# Altium project INS_Housing.PrjPcb
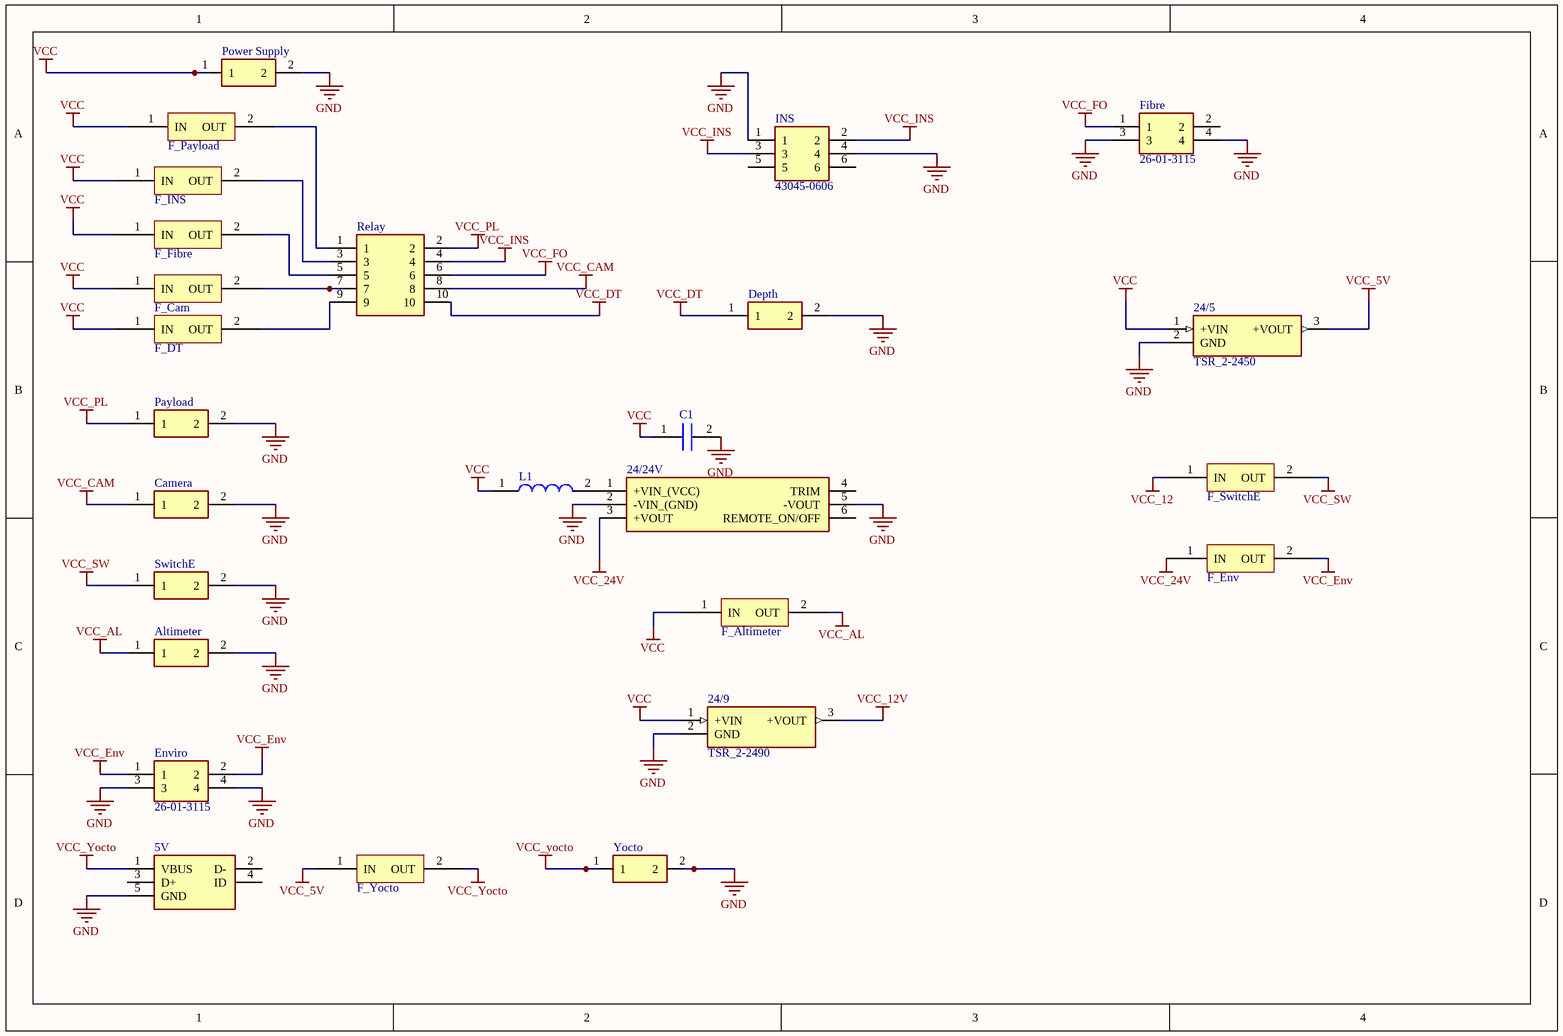
[diagram p0: Main.SchDoc]
1 sheet, 26 parts. Net scope: global (net labels, ports and power ports of the same name join across sheets).
Board file: Main.PcbDoc

## Sheet Main.SchDoc: Squidbot INS Powerboard
size A4; Author: Renan Freitas; DocumentNumber: SQBT-S-0002; Revision: 0; SheetSize: A4; DocumentName: SQBT-S-0002

### Parts
5V  47346-0001  [47346-0001]  (value not drawn)
24/5  TSR_2-2450  [TSR-2]
24/9  TSR_2-2490  [TSR-2]
24/24V  THN_30-2415WI  [THN_30]  (value not drawn)
Altimeter  43650-0212  [43650-0214]  (value not drawn)
C1  C0805S472K5RACAUTO  [CAPC2012X88N]  (value not drawn)
Camera  43650-0212  [43650-0214]  (value not drawn)
Depth  43650-0212  [43650-0214]  (value not drawn)
Enviro  26-01-3115  [39-30-1040]
F_Altimeter  FUSEHOLDERS PC Mount 5x20mm Fuses  [FUSEHOLDER 5x20]  (value not drawn)
F_Cam  FUSEHOLDERS PC Mount 5x20mm Fuses  [FUSEHOLDER 5x20]  (value not drawn)
F_DT  FUSEHOLDERS PC Mount 5x20mm Fuses  [FUSEHOLDER 5x20]  (value not drawn)
F_Env  FUSEHOLDERS PC Mount 5x20mm Fuses  [FUSEHOLDER 5x20]  (value not drawn)
F_Fibre  FUSEHOLDERS PC Mount 5x20mm Fuses  [FUSEHOLDER 5x20]  (value not drawn)
F_INS  FUSEHOLDERS PC Mount 5x20mm Fuses  [FUSEHOLDER 5x20]  (value not drawn)
F_Payload  FUSEHOLDERS PC Mount 5x20mm Fuses  [FUSEHOLDER 5x20]  (value not drawn)
F_SwitchE  FUSEHOLDERS PC Mount 5x20mm Fuses  [FUSEHOLDER 5x20]  (value not drawn)
F_Yocto  FUSEHOLDERS PC Mount 5x20mm Fuses  [FUSEHOLDER 5x20]  (value not drawn)
Fibre  26-01-3115  [39-30-1040]
INS  43045-0606  [43045-0606]
L1  XEL6060-222MEB  [XAL6060153MEC]  (value not drawn)
Payload  43650-0212  [43650-0214]  (value not drawn)
Power_Supply  76825-0002  [768250002]  (value not drawn)
Relay  105405-1110  [105405-1110]  (value not drawn)
SwitchE  43650-0212  [43650-0214]  (value not drawn)
Yocto  43650-0212  [43650-0214]  (value not drawn)

### Nets
GND: 5V.5(GND) 24/5.2(GND) 24/9.2(GND) 24/24V.2(-VIN_(GND)) 24/24V.5(-VOUT) Altimeter.2 C1.2 Camera.2 Depth.2 Enviro.3 Enviro.4 Fibre.3 Fibre.4 INS.1 INS.4 Payload.2 Power_Supply.2 SwitchE.2 Yocto.2
VCC: 24/5.1(+VIN) 24/9.1(+VIN) C1.1 F_Altimeter.1(IN) F_Cam.1(IN) F_DT.1(IN) F_Fibre.1(IN) F_INS.1(IN) F_Payload.1(IN) L1.1 Power_Supply.1
VCC_5V: 24/5.3(+VOUT) F_Yocto.1(IN)
VCC_12: F_SwitchE.1(IN)
VCC_12V: 24/9.3(+VOUT)
VCC_24V: 24/24V.3(+VOUT) F_Env.1(IN)
VCC_AL: Altimeter.1 F_Altimeter.2(OUT)
VCC_CAM: Camera.1 Relay.8
VCC_DT: Depth.1 Relay.10
VCC_Env: Enviro.1 Enviro.2 F_Env.2(OUT)
VCC_FO: Fibre.1 Relay.6
VCC_INS: INS.2 INS.3 Relay.4
VCC_PL: Payload.1 Relay.2
VCC_SW: F_SwitchE.2(OUT) SwitchE.1
VCC_Yocto: 5V.1(VBUS) F_Yocto.2(OUT) Yocto.1
Net24/24V_1: 24/24V.1(+VIN_(VCC)) L1.2
NetF_Cam_2: F_Cam.2(OUT) Relay.7
NetF_DT_2: F_DT.2(OUT) Relay.9
NetF_Fibre_2: F_Fibre.2(OUT) Relay.5
NetF_INS_2: F_INS.2(OUT) Relay.3
NetF_Payload_2: F_Payload.2(OUT) Relay.1

Not connected (* = marked no-connect by the designer): 5V 2(D-) 3(D+) 4(ID); 24/24V 4(TRIM) 6(REMOTE_ON/OFF); Fibre 2; INS 5 6

### Library data of the parts
5V = 47346-0001: Connector; Manufacturer_Name: Molex; Datasheet Link: https://componentsearchengine.com/Datasheets/1/47346-0001.pdf; Mouser Part Number: 538-47346-0001; Mouser Price/Stock: https://www.mouser.com/Search/Refine.aspx?Keyword=538-47346-0001; Manufacturer_Part_Number: 47346-0001
24/5 = TSR_2-2450: Power Supply; Manufacturer_Name: Traco Power; Manufacturer_Part_Number: TSR 2-2450; Datasheet Link: https://componentsearchengine.com/Datasheets/1/TSR 2-2450.pdf; Mouser Part Number: 495-TSR2-2450; Mouser Price/Stock: https://www.mouser.com/Search/Refine.aspx?Keyword=495-TSR2-2450
24/9 = TSR_2-2490: Power Supply; Manufacturer_Name: Traco Power; Manufacturer_Part_Number: TSR 2-2490; Datasheet Link: https://componentsearchengine.com/Datasheets/1/TSR 2-2490.pdf; Mouser Part Number: 495-TSR2-2490; Mouser Price/Stock: https://www.mouser.com/Search/Refine.aspx?Keyword=495-TSR2-2490
24/24V = THN_30-2415WI: Power Supply; Manufacturer_Name: Traco Power; Manufacturer_Part_Number: THN 30-2415WI; Datasheet Link: https://componentsearchengine.com/Datasheets/1/THN 30-2415WI.pdf; Mouser Part Number: 495-THN30-2415WI; Mouser Price/Stock: https://www.mouser.com/Search/Refine.aspx?Keyword=495-THN30-2415WI
Altimeter Camera Depth Payload SwitchE Yocto = 43650-0212: Connector; Manufacturer_Name: Molex; Datasheet Link: https://componentsearchengine.com/Datasheets/1/43650-0212.pdf; Mouser Part Number: 538-43650-0212; Mouser Price/Stock: https://www.mouser.com/Search/Refine.aspx?Keyword=538-43650-0212; Manufacturer_Part_Number: 43650-0212
C1 = C0805S472K5RACAUTO: Capacitor; Manufacturer_Name: Kemet; Datasheet Link: https://componentsearchengine.com/Datasheets/1/C0805S472K5RACAUTO.pdf; Height: 0.88mm; Mouser Part Number: 80-C0805S472K5RAUTO; Mouser Price/Stock: https://www.mouser.com/Search/Refine.aspx?Keyword=80-C0805S472K5RAUTO; Manufacturer_Part_Number: C0805S472K5RACAUTO
Enviro Fibre = 26-01-3115: Connector; Manufacturer_Name: Molex; Datasheet Link: https://componentsearchengine.com/Datasheets/1/26-01-3115.pdf; Mouser Part Number: 538-26-01-3115; Mouser Price/Stock: https://www.mouser.com/Search/Refine.aspx?Keyword=538-26-01-3115; Manufacturer_Part_Number: 26-01-3115
INS = 43045-0606: Connector; Manufacturer_Name: Molex; Datasheet Link: https://componentsearchengine.com/Datasheets/1/43045-0606.pdf; Mouser Part Number: 538-43045-0606; Mouser Price/Stock: https://www.mouser.com/Search/Refine.aspx?Keyword=538-43045-0606; Manufacturer_Part_Number: 43045-0606
L1 = XEL6060-222MEB: Inductor; Manufacturer_Name: COILCRAFT; Datasheet Link: https://componentsearchengine.com/Datasheets/1/XEL6060-222MEB.pdf; Mouser Part Number: 994-XEL6060-222MEB; Mouser Price/Stock: https://www.mouser.com/Search/Refine.aspx?Keyword=994-XEL6060-222MEB; Manufacturer_Part_Number: XEL6060-222MEB
Power_Supply = 76825-0002: Connector; Manufacturer_Name: Molex; Datasheet Link: https://componentsearchengine.com/Datasheets/1/76825-0002.pdf; Height: 14mm; Mouser Part Number: 538-76825-0002; Mouser Price/Stock: https://www.mouser.com/Search/Refine.aspx?Keyword=538-76825-0002; Manufacturer_Part_Number: 76825-0002
Relay = 105405-1110: Connector; Manufacturer_Name: Molex; Datasheet Link: https://componentsearchengine.com/Datasheets/1/105405-1110.pdf; Mouser Part Number: 538-105405-1110; Mouser Price/Stock: https://www.mouser.com/Search/Refine.aspx?Keyword=538-105405-1110; Manufacturer_Part_Number: 105405-1110